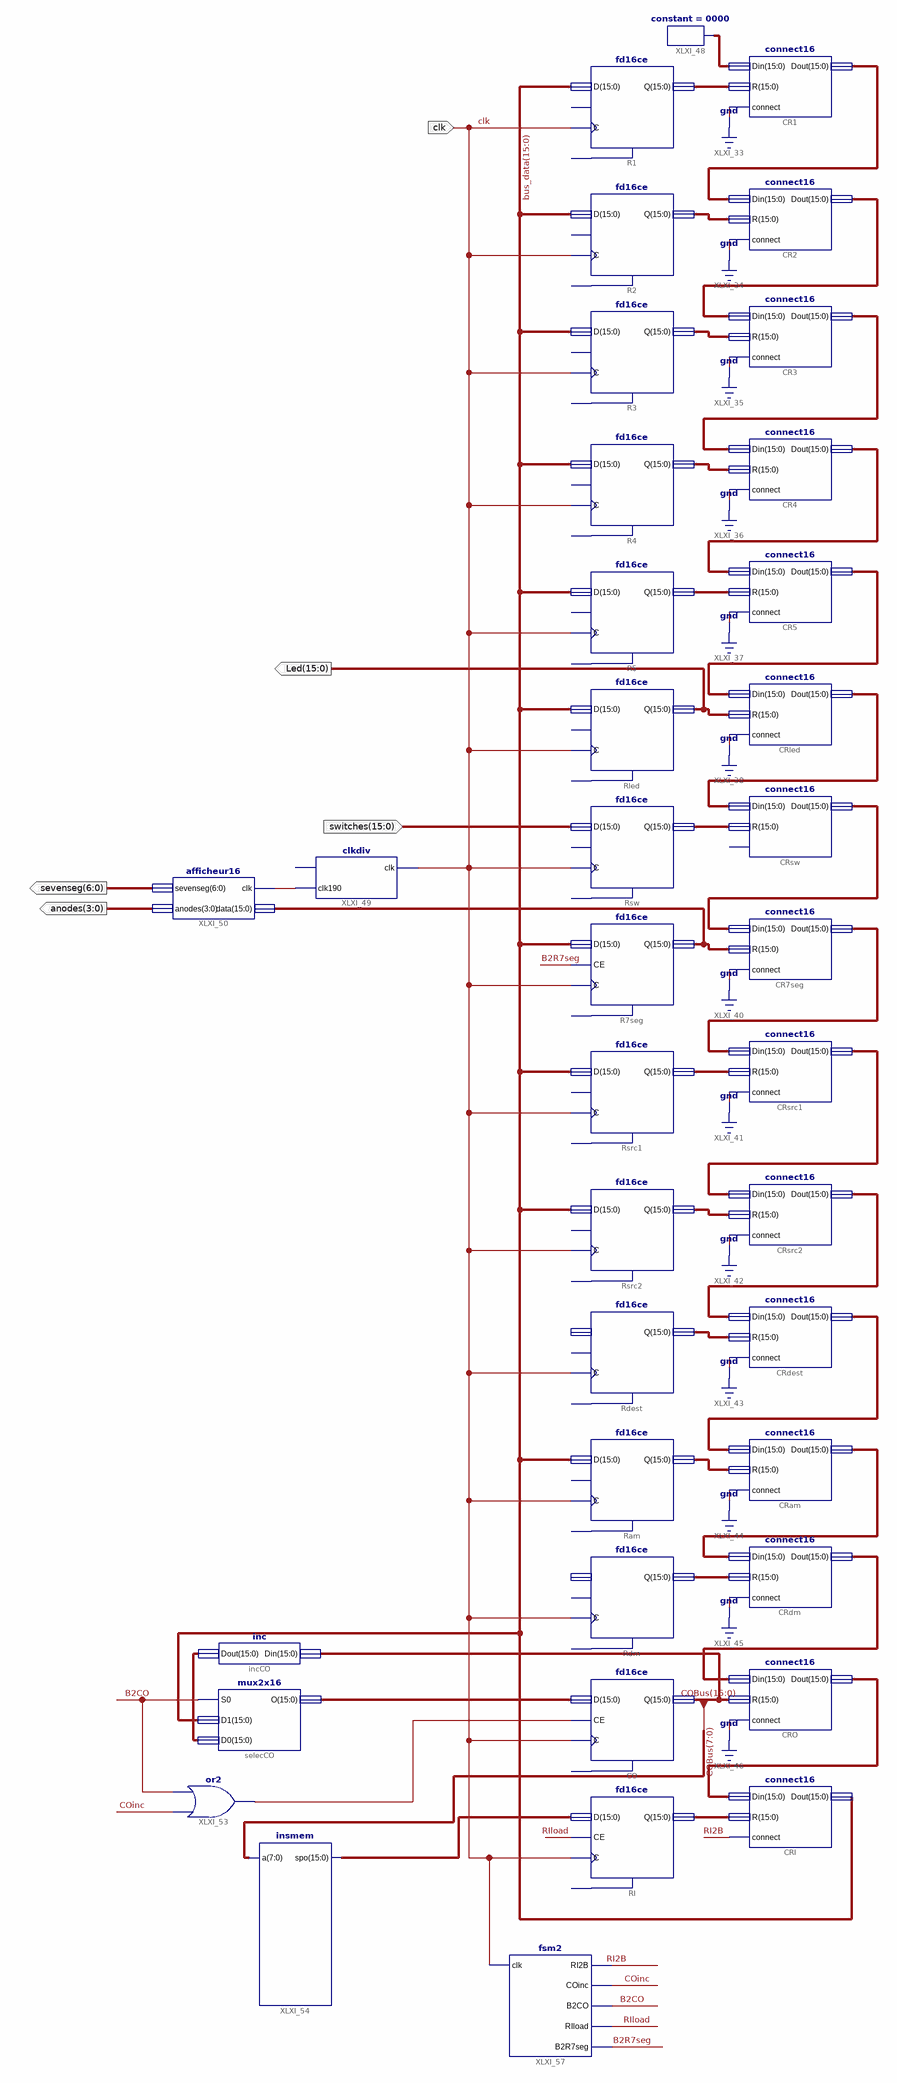
[diagram p0: schematic sheet 1]
// Xilinx ISE schematic S3.sch (spartan3e) as structural Verilog: 38 symbols, 5 ports
module S3 (
  input  clk,
  input  [15:0] switches,
  output [15:0] Led,
  output [3:0] anodes,
  output [6:0] sevenseg
);

  wire B2CO, B2R7seg, COinc, RI2B, RIload, XLXN_79, XLXN_85;
  wire [15:0] bus_data, COBus, XLXN_1, XLXN_2, XLXN_3, XLXN_4, XLXN_5, XLXN_7, XLXN_8, XLXN_9, XLXN_10,
       XLXN_11, XLXN_12, XLXN_13, XLXN_15, XLXN_31, XLXN_32, XLXN_33, XLXN_34, XLXN_35, XLXN_36, XLXN_37,
       XLXN_38, XLXN_39, XLXN_40, XLXN_41, XLXN_42, XLXN_43, XLXN_45, XLXN_46, XLXN_80, XLXN_88, XLXN_89;

  fd16ce R1 (.C(clk), .D(bus_data), .Q(XLXN_1));  // open: CE, CLR
  fd16ce R2 (.C(clk), .D(bus_data), .Q(XLXN_2));  // open: CE, CLR
  fd16ce R3 (.C(clk), .D(bus_data), .Q(XLXN_3));  // open: CE, CLR
  fd16ce R4 (.C(clk), .D(bus_data), .Q(XLXN_4));  // open: CE, CLR
  fd16ce R5 (.C(clk), .D(bus_data), .Q(XLXN_5));  // open: CE, CLR
  fd16ce Rled (.C(clk), .D(bus_data), .Q(Led));  // open: CE, CLR
  fd16ce Rsw (.C(clk), .D(switches), .Q(XLXN_7));  // open: CE, CLR
  fd16ce R7seg (.C(clk), .CE(B2R7seg), .D(bus_data), .Q(XLXN_8));  // open: CLR
  fd16ce Rsrc1 (.C(clk), .D(bus_data), .Q(XLXN_9));  // open: CE, CLR
  fd16ce Rsrc2 (.C(clk), .D(bus_data), .Q(XLXN_10));  // open: CE, CLR
  fd16ce Rdest (.C(clk), .Q(XLXN_11));  // open: CE, CLR, D
  fd16ce Ram (.C(clk), .D(bus_data), .Q(XLXN_12));  // open: CE, CLR
  fd16ce Rdm (.C(clk), .Q(XLXN_13));  // open: CE, CLR, D
  fd16ce CO (.C(clk), .CE(XLXN_85), .D(XLXN_89), .Q(COBus));  // open: CLR
  fd16ce RI (.C(clk), .CE(RIload), .D(XLXN_88), .Q(XLXN_15));  // open: CLR
  connect16 CR1 (.Din(XLXN_46), .R(XLXN_1), .connect(1'b0), .Dout(XLXN_31));
  connect16 CR2 (.Din(XLXN_31), .R(XLXN_2), .connect(1'b0), .Dout(XLXN_32));
  connect16 CR3 (.Din(XLXN_32), .R(XLXN_3), .connect(1'b0), .Dout(XLXN_33));
  connect16 CR4 (.Din(XLXN_33), .R(XLXN_4), .connect(1'b0), .Dout(XLXN_34));
  connect16 CR5 (.Din(XLXN_34), .R(XLXN_5), .connect(1'b0), .Dout(XLXN_35));
  connect16 CRled (.Din(XLXN_35), .R(Led), .connect(1'b0), .Dout(XLXN_36));
  connect16 CRsw (.Din(XLXN_36), .R(XLXN_7), .Dout(XLXN_37));  // open: connect
  connect16 CR7seg (.Din(XLXN_37), .R(XLXN_8), .connect(1'b0), .Dout(XLXN_39));
  connect16 CRsrc1 (.Din(XLXN_39), .R(XLXN_9), .connect(1'b0), .Dout(XLXN_38));
  connect16 CRsrc2 (.Din(XLXN_38), .R(XLXN_10), .connect(1'b0), .Dout(XLXN_40));
  connect16 CRdest (.Din(XLXN_40), .R(XLXN_11), .connect(1'b0), .Dout(XLXN_41));
  connect16 CRam (.Din(XLXN_41), .R(XLXN_12), .connect(1'b0), .Dout(XLXN_42));
  connect16 CRdm (.Din(XLXN_42), .R(XLXN_13), .connect(1'b0), .Dout(XLXN_43));
  connect16 CRO (.Din(XLXN_43), .R(COBus), .connect(1'b0), .Dout(XLXN_45));
  constant #(.CValue("0000")) XLXI_48 (.O(XLXN_46));
  clkdiv XLXI_49 (.clk(clk), .clk190(XLXN_79));  // open: clksec
  afficheur16 XLXI_50 (.clk(XLXN_79), .data(XLXN_8), .sevenseg(sevenseg), .anodes(anodes));
  inc incCO (.Din(COBus), .Dout(XLXN_80));
  mux2x16 selecCO (.S0(B2CO), .D1(bus_data), .D0(XLXN_80), .O(XLXN_89));
  or XLXI_53 (XLXN_85, COinc, B2CO);
  insmem XLXI_54 (.a(COBus[7:0]), .spo(XLXN_88));
  connect16 CRI (.Din(XLXN_45), .R(XLXN_15), .connect(RI2B), .Dout(bus_data));
  fsm2 XLXI_57 (.clk(clk), .RI2B(RI2B), .COinc(COinc), .B2CO(B2CO), .RIload(RIload), .B2R7seg(B2R7seg));
endmodule
